# Altium schematic sheet Interface_IO.SchDoc: BluetoothGateway
size A3; DrawnBy: Q.Thang & T.Khoa; Revision: V1.0.0; SheetNumber: 16; SheetTotal: 17
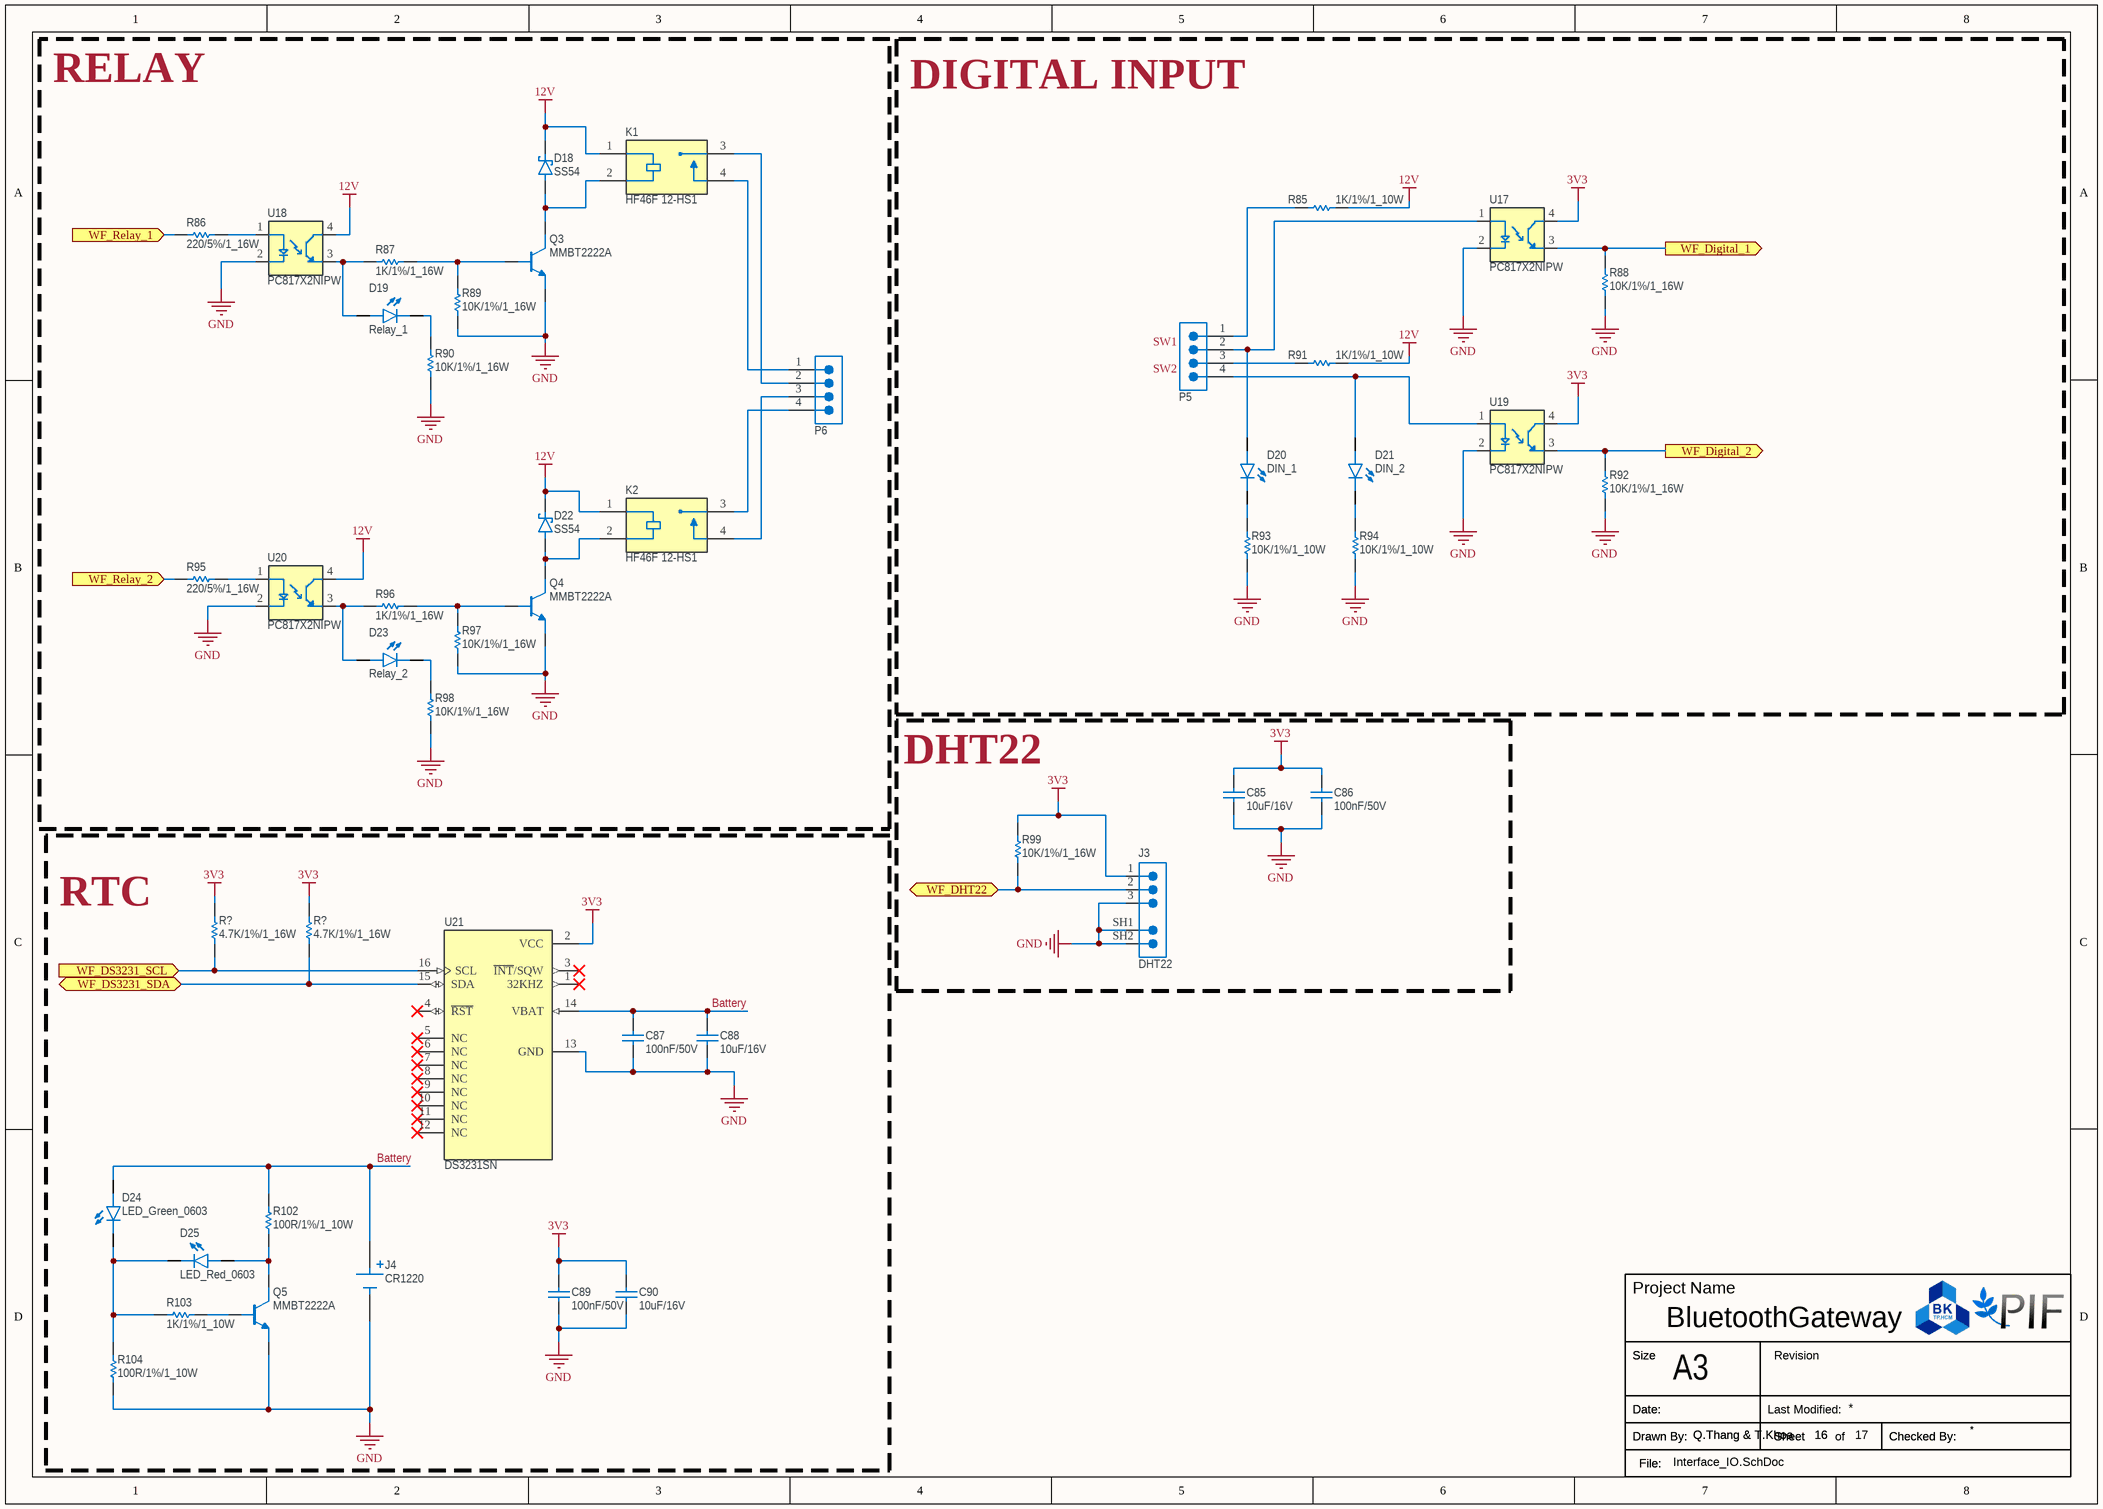
[diagram p0: Interface_IO.SchDoc]

## Parts
(Parts that share a designator on the sheet are numbered #1, #2 ... from top to bottom, then left to right.)
C85  10uF/16V  [CAP_0603]
C86  100nF/50V  [CAP_0603]
C87  100nF/50V  [CAP_0603]
C88  10uF/16V  [CAP_0603]
C89  100nF/50V  [CAP_0603]
C90  10uF/16V  [CAP_0603]
D18  SS54  [D_SMA]
D19  Relay_1  [LED_0603Y]
D20  DIN_1  [LED_0603Y]
D21  DIN_2  [LED_0603Y]
D22  SS54  [D_SMA]
D23  Relay_2  [LED_0603Y]
D24  LED_Green_0603  [LED_0603G]
D25  LED_Red_0603  [LED_0603R]
J3  DHT22  [JST_SH_BM03B-SRSS-TB_1x03-1MP_P1.00mm_horizontal]
J4  CR1220  [Battery_Holder_CR1220]
K1  HF46F 12-HS1  [RELAY_HF46F_005-HS1]
K2  HF46F 12-HS1  [RELAY_HF46F_005-HS1]
P5  3.81mm_4P  [Terminal_Block_3.81mm_4P]  (value not drawn)
P6  3.81mm_4P  [Terminal_Block_3.81mm_4P]  (value not drawn)
Q3  MMBT2222A  [SOT-23]
Q4  MMBT2222A  [SOT-23]
Q5  MMBT2222A  [SOT-23]
R85  1K/1%/1_10W  [Resistor_0603]
R86  220/5%/1_16W  [RESISTOR_0402]
R87  1K/1%/1_16W  [RESISTOR_0402]
R88  10K/1%/1_16W  [RESISTOR_0402]
R89  10K/1%/1_16W  [RESISTOR_0402]
R90  10K/1%/1_16W  [RESISTOR_0402]
R91  1K/1%/1_10W  [Resistor_0603]
R92  10K/1%/1_16W  [RESISTOR_0402]
R93  10K/1%/1_10W  [Resistor_0603]
R94  10K/1%/1_10W  [Resistor_0603]
R95  220/5%/1_16W  [RESISTOR_0402]
R96  1K/1%/1_16W  [RESISTOR_0402]
R97  10K/1%/1_16W  [RESISTOR_0402]
R98  10K/1%/1_16W  [RESISTOR_0402]
R99  10K/1%/1_16W  [RESISTOR_0402]
R102  100R/1%/1_10W  [Resistor_0603]
R103  1K/1%/1_10W  [Resistor_0603]
R104  100R/1%/1_10W  [Resistor_0603]
R?#1  4.7K/1%/1_16W  [RESISTOR_0402]
R?#2  4.7K/1%/1_16W  [RESISTOR_0402]
U17  PC817X2NIPW  [SOP-4]
U18  PC817X2NIPW  [SOP-4]
U19  PC817X2NIPW  [SOP-4]
U20  PC817X2NIPW  [SOP-4]
U21  DS3231SN  [SOIC-16]

## Blocks framed on the sheet
RELAY: D18 D19 D22 D23 K1 K2 P6 Q3 Q4 R86 R87 R89 R90 R95-R98 U18 U20
DIGITAL INPUT: D20 D21 P5 R85 R88 R91-R94 U17 U19
DHT22: C85 C86 J3 R99
RTC: C87-C90 D24 D25 J4 Q5 R102-R104 R?#1 R?#2 U21

## Ports
WF_DHT22 (bidir, see Overview_Schematic[6B], ESP32_WiFi[2B]), WF_Digital_1 (out, see Overview_Schematic[6B], ESP32_WiFi[2B]), WF_Digital_2 (out, see Overview_Schematic[6B], ESP32_WiFi[2B]), WF_DS3231_SCL (in, see Overview_Schematic[6B], ESP32_WiFi[3B]), WF_DS3231_SDA (bidir, see Overview_Schematic[6B], ESP32_WiFi[3B]), WF_Relay_1 (in, see Overview_Schematic[6B], ESP32_WiFi[2B]), WF_Relay_2 (in, see Overview_Schematic[6B], ESP32_WiFi[2B])

## Nets
3V3: C85.2 C86.2 C89.2 C90.2 J3.1 R99.2 R?#1.2 R?#2.2 U17.4(CT) U19.4(CT) U21.2(VCC)
12V: D18.1(C) D22.1(C) K1.1(COIL1) K2.1(COIL1) R85.1 R91.1 U18.4(CT) U20.4(CT)
GND: C85.1 C86.1 C87.1 C88.1 C89.1 C90.1 J3.3 J3.SH1(SHIELD) J3.SH2(SHIELD) J4.N(NEG) Q3.2(E) Q4.2(E) Q5.2(E) R88.1 R89.1 R90.1 R92.1 R93.1 R94.1 R97.1 R98.1 R104.1 U17.2(C) U18.2(C) U19.2(C) U20.2(C) U21.13(GND)
Battery: C87.2 C88.2 D24.A J4.P(POS) R102.2 U21.14(VBAT)
WF_DHT22: J3.2 R99.1 ; port WF_DHT22
WF_Digital_1: R88.2 U17.3(ET) ; port WF_Digital_1
WF_Digital_2: R92.2 U19.3(ET) ; port WF_Digital_2
WF_DS3231_SCL: R?#1.1 U21.16(SCL) ; port WF_DS3231_SCL
WF_DS3231_SDA: R?#2.1 U21.15(SDA) ; port WF_DS3231_SDA
WF_Relay_1: R86.1 ; port WF_Relay_1
WF_Relay_2: R95.1 ; port WF_Relay_2
NetD18_2: D18.2(A) K1.2(COIL2) Q3.3(C)
NetD19_A: D19.A R87.1 U18.3(ET)
NetD19_C: D19.C R90.2
NetD20_A: D20.A P5.2 U17.1(A)
NetD20_C: D20.C R93.2
NetD21_A: D21.A P5.4 U19.1(A)
NetD21_C: D21.C R94.2
NetD22_2: D22.2(A) K2.2(COIL2) Q4.3(C)
NetD23_A: D23.A R96.1 U20.3(ET)
NetD23_C: D23.C R98.2
NetD24_C: D24.C D25.C R103.1 R104.2
NetD25_A: D25.A Q5.3(C) R102.1
NetK1_3: K1.3(COM) P6.2
NetK1_4: K1.4(NO) P6.1
NetK2_3: K2.3(COM) P6.4
NetK2_4: K2.4(NO) P6.3
NetP5_1: P5.1 R85.2
NetP5_3: P5.3 R91.2
NetQ3_1: Q3.1(B) R87.2 R89.2
NetQ4_1: Q4.1(B) R96.2 R97.2
NetQ5_1: Q5.1(B) R103.2
NetR86_2: R86.2 U18.1(A)
NetR95_2: R95.2 U20.1(A)

Not connected (* = marked no-connect by the designer): U21 1(32KHZ)* 3(~{INT}/SQW)* 4(~{RST})* 5(NC)* 6(NC)* 7(NC)* 8(NC)* 9(NC)* 10(NC)* 11(NC)* 12(NC)*

## Notes on the sheet
- (near P5) SW1
- (near P5) SW2
- Project Name
- Size
- A3
- Revision
- Drawn By:
- Date:
- File:
- Last Modified:
- Sheet
- of
- Checked By:

## Library data of the parts
C85 C88 C90 = Ceramic_Cap_10uF_16V_0603: CAP, size 0603, 10uF, 16V; Supply Part Number: Tụ Gốm 0603 10uF 16V; Supply Name: Thegioiic; Datasheet: *; Supply URL: https://www.thegioiic.com/tu-gom-0603-10uf-16v
C86 C87 C89 = Ceramic_Cap_100nF_50V_0603: CAP, size 0603, 100nF, 50V; Supply Part Number: Tụ Gốm 0603 100nF (0.1uF) 50V; Supply Name: Thegioiic; Datasheet: *; Supply URL: https://www.thegioiic.com/tu-gom-0603-100nf-0-1uf-50v
D18 D22 = Diode_SS54: Diode Schottky 40V 5A Surface Mount SMA; Supply Part Number: SS54 SMA Diode Shotky 5A 40V; Supply Name: Thegioiic; Datasheet: https://www.thegioiic.com/upload/documents/dc8a63b3eda4738bc390d9dc570a4e18.pdf; Supply URL: https://www.thegioiic.com/ss54-sma-diode-shotky-5a-40v
D19-D21 D23 = LED_Yellow_0603: LED Yellow 0603; Supply Part Number: LED Vàng 0603 Dán SMD Trong Suốt Harvatek; Supply Name: Thegioiic; Supply URL: https://www.thegioiic.com/led-vang-0603-dan-smd-trong-suot-harvatek
D24 = LED_Green_0603: LED Green 0603; Supply Part Number: LED Xanh Lá 0603 Dán SMD Trong Suốt Harvatek; Supply Name: Thegioiic; Supply URL: https://www.thegioiic.com/led-xanh-la-0603-dan-smd-trong-suot-harvatek
D25 = LED_Red_0603: LED Red 0603; Supply Part Number: LED Đỏ 0603 Dán SMD Trong Suốt Harvatek; Supply Name: Thegioiic; Supply URL: https://www.thegioiic.com/led-do-0603-dan-smd-trong-suot-harvatek
J3 = SH_1mm_3P: Đầu SH1.0mm 3 Chân Dán SMD Nằm Ngang; Supply Name: Thegioiic; Supply Part Number: Đầu SH1.0mm 3 Chân Dán SMD Nằm Ngang; Supply URL: https://www.thegioiic.com/dau-sh1-0mm-3-chan-dan-smd-nam-ngang
J4 = Battery_Holder_CR1220: Coin Cell Battery Retainer, Horizontal SMT, for CR1220 Coin Cell Batteries, Tape & Reeled; Supply Part Number: Đế Pin CR1220 Dán SMD; Supply Name: Thegioiic; Datasheet: *; Supply URL: https://www.thegioiic.com/de-pin-cr1220-dan-smd
K1 K2 = HF46F 12-HS1: 4 chân xuyên lỗ; Supply Part Number: HF46F 12-HS1 Rơ Le 12VDC 5A SPST-NO 4 Chân; Supply Name: Thegioiic; Datasheet: https://www.thegioiic.com/upload/documents/1734591411_HF-Xiamen-Hongfa-Electroacoustic-HF46F.pdf; Supply URL: https://www.thegioiic.com/hf46f-12-hs1-ro-le-12vdc-5a-spst-no-4-chan
P5 P6 = Terminal_Block_3.81mm_4P: Terminal Block THT, pitch 3.81mm, 4p, 300V 10A; Supply Part Number: UL-3.81-4-R Terminal Block Plug-in Hàn PCB 4 Chân Cong 3.81mm 300V 10A ULO; Supply Name: Thegioiic; ComponentLink1Description: Website Link; ComponentLink1URL: https://www.we-online.com/redexpert/article/691322310004?ad; ComponentLink2Description: Datasheet Link; ComponentLink2URL: https://www.we-online.com/redexpert/spec/691322310004?ad; Supply URL: https://www.thegioiic.com/ul-3-81-4-r-terminal-block-plug-in-han-pcb-4-chan-cong-3-81mm-300v-10a-ulo
Q3-Q5 = MMBT2222A: Điện áp Vce max: 40V, dòng Ic max: 0.6A, công suất: 0.3W; Supply Part Number: MMBT2222A 1P Transistor NPN 40V 0.6A 3 Chân SOT-23; Supply Name: Thegioiic; Datasheet: https://www.thegioiic.com/upload/documents/1734592311_MMBT2222A.pdf; Supply URL: https://www.thegioiic.com/mmbt2222a-1p-transistor-npn-40v-0-6a-3-chan-sot-23
R85 R91 R103 = Res_1K_0603_1%: Resistor 0603 1KOhm 1% 1_10W; Supply Part Number: Điện Trở 1 KOhm 0603 1%; Supply Name: Thegioiic; Supply URL: https://www.thegioiic.com/dien-tro-1-kohm-0603-1-
R86 R95 = Res_220R_0402_5%: Resistor 0402 220 Ohm 5% 1_16W; Supply Part Number: Điện Trở 220 Ohm 0402 5%; Supply Name: Thegioiic; Supply URL: https://www.thegioiic.com/dien-tro-220-ohm-0402-5-
R87 R96 = Res_1K_0402_1%: Resistor 0402 1KOhm 1% 1_16W; Supply Part Number: Điện Trở 1 KOhm 0402 1%; Supply Name: Thegioiic; Supply URL: https://www.thegioiic.com/dien-tro-1-kohm-0402-1-
R88-R90 R92 R97-R99 = Res_10K_0402_1%: Resistor 0402 10KOhm 1% 1_16W; Supply Part Number: Điện Trở 10 KOhm 0402 1%; Supply Name: Thegioiic; Supply URL: https://www.thegioiic.com/dien-tro-10-kohm-0402-1-
R93 R94 = Res_10K_0603_1%: Resistor 0603 10KOhm 1% 1_10W; Supply Part Number: Điện Trở 10 KOhm 0603 1%; Supply Name: Thegioiic; Supply URL: https://www.thegioiic.com/dien-tro-10-kohm-0603-1-
R102 R104 = Res_100R_0603_1%: Resistor 0603 100 Ohm 1% 1_10W; Supply Part Number: Điện Trở 100 Ohm 0603 1%; Supply Name: Thegioiic; Supply URL: https://www.thegioiic.com/dien-tro-100-ohm-0603-1-
R?#1 R?#2 = Res_4.7K_0402_1%: Resistor 0402 4.7KOhm 1% 1_16W; Supply Part Number: Điện Trở 4.7 KOhm 0402 1%; Supply Name: Thegioiic; Supply URL: https://www.thegioiic.com/dien-tro-4-7-kohm-0402-1-
U17-U20 = PC817X2NIPW: Optocoupler DC-IN 1-CH Transistor DC-OUT 4-Pin; Supply Part Number: PC817X2NIPW Optoisolator Transistor Output 5000Vrms 1 Channel, SOP-4; Supply Name: Thegioiic; Datasheet: https://www.alldatasheet.com/datasheet-pdf/view/525168/SHARP/PC817X2NIP0F.html; Supply URL: https://www.thegioiic.com/pc817x2nipw-optoisolator-transistor-output-5000vrms-1-channel-sop-4
U21 = DS3231SN: Real Time Clock (RTC) IC Clock/Calendar - I²C, 2-Wire Serial 16-SOIC (0.295, 7.50mm Width); Supply Part Number: DS3231SN#T&R IC RTC Clock/Calendar; Supply Name: Thegioiic; Datasheet: https://www.mouser.com/datasheet/2/256/DS3231-102175.pdf; Supply URL: https://www.thegioiic.com/ds3231sn-t-r-ic-rtc-clock-calendar-16-sop